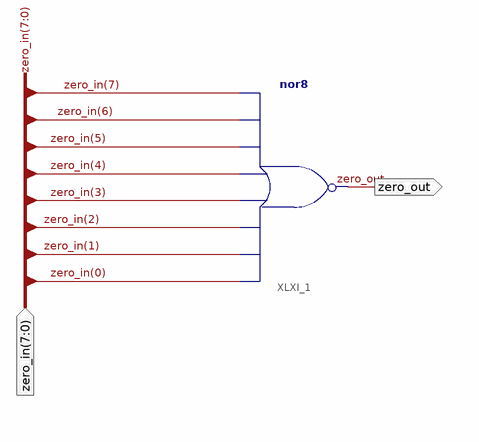
[diagram p0: schematic sheet 1]
// Xilinx ISE schematic nor8.sch (spartan3e) as structural Verilog: 1 symbols, 2 ports
module nor8 (
  input  [7:0] zero_in,
  output zero_out
);

  nor XLXI_1 (zero_out, zero_in[0], zero_in[1], zero_in[2], zero_in[3], zero_in[4], zero_in[5], zero_in[6], zero_in[7]);
endmodule
